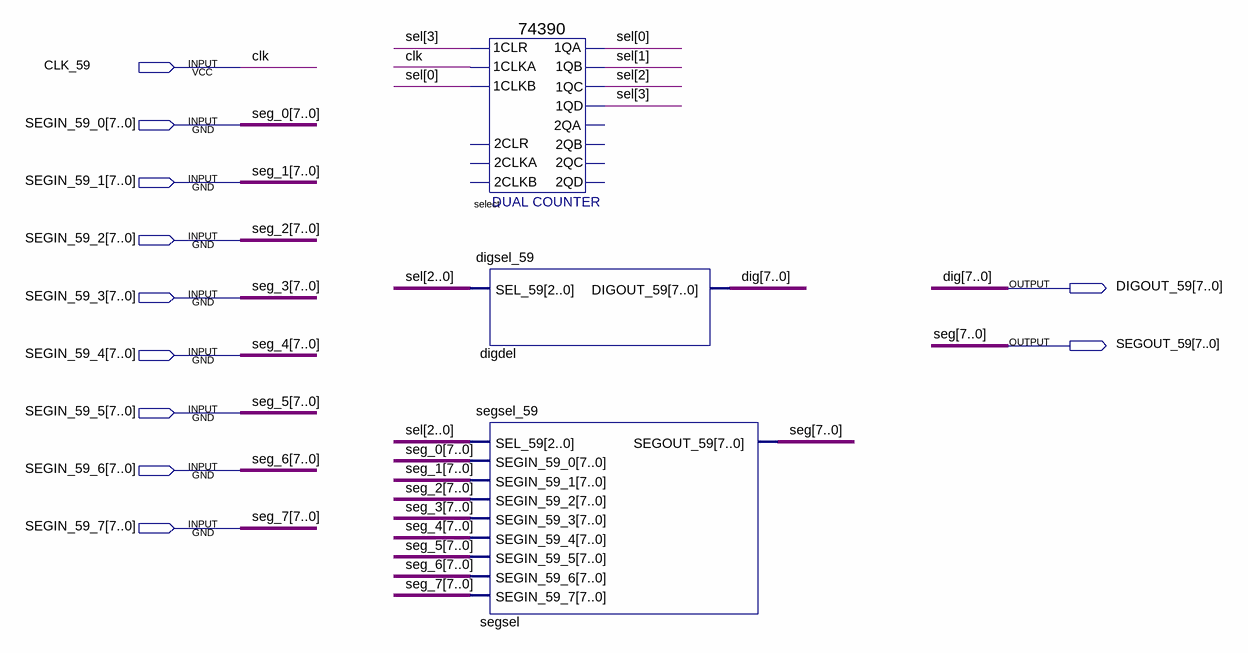
[diagram p0: schematic sheet]
// Quartus schematic display_59.bdf as structural Verilog: 3 symbols, 11 pins
module display_59 (
  input  CLK_59,
  input  [7:0] SEGIN_59_0,
  input  [7:0] SEGIN_59_1,
  input  [7:0] SEGIN_59_2,
  input  [7:0] SEGIN_59_3,
  input  [7:0] SEGIN_59_4,
  input  [7:0] SEGIN_59_5,
  input  [7:0] SEGIN_59_6,
  input  [7:0] SEGIN_59_7,
  output [7:0] DIGOUT_59,
  output [7:0] SEGOUT_59
);

  wire [3:0] sel;

  \74390  select (
    .\1CLR (sel[3]), .\1CLKA (CLK_59), .\1CLKB (sel[0]), .\1QA (sel[0]), .\1QB (sel[1]), .\1QC (sel[2]),
    .\1QD (sel[3]));  // open: 2CLKA, 2CLR, 2CLKB, 2QA, 2QB, 2QC, 2QD
  digsel_59 digdel (.SEL_59(sel[2:0]), .DIGOUT_59(DIGOUT_59));
  segsel_59 segsel (
    .SEL_59(sel[2:0]), .SEGIN_59_0(SEGIN_59_0), .SEGIN_59_1(SEGIN_59_1), .SEGIN_59_2(SEGIN_59_2),
    .SEGIN_59_3(SEGIN_59_3), .SEGIN_59_4(SEGIN_59_4), .SEGIN_59_5(SEGIN_59_5), .SEGIN_59_6(SEGIN_59_6),
    .SEGIN_59_7(SEGIN_59_7), .SEGOUT_59(SEGOUT_59));

  // Other names for the same wires on the sheet: clk = CLK_59; dig[7:0] = DIGOUT_59; seg[7:0] = SEGOUT_59;
  //   seg_0[7:0] = SEGIN_59_0; seg_1[7:0] = SEGIN_59_1; seg_2[7:0] = SEGIN_59_2; seg_3[7:0] = SEGIN_59_3;
  //   seg_4[7:0] = SEGIN_59_4; seg_5[7:0] = SEGIN_59_5; seg_6[7:0] = SEGIN_59_6; seg_7[7:0] = SEGIN_59_7
endmodule
